# Altium schematic sheet Outputs.SchDoc
size 101 x 152 mm; SheetNumber: 6; SheetTotal: 9
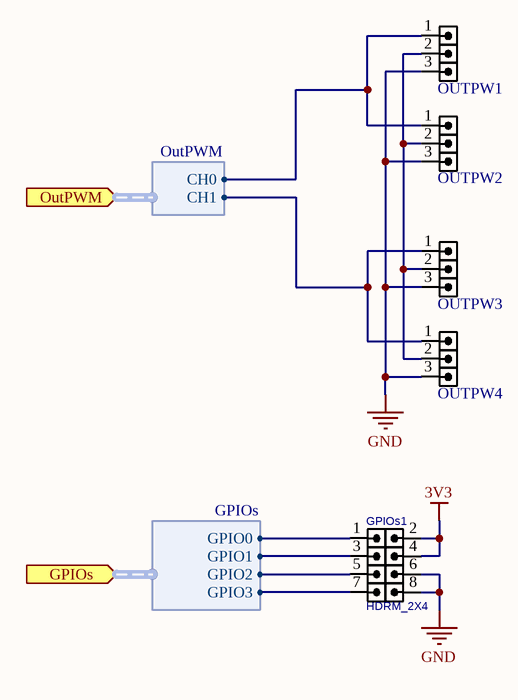
[diagram p0: Outputs.SchDoc]

## Parts
GPIOs1  HDRM_2X4  [HDR_M_2X4]
OUTPW1  HDRM3  [HDR_M_1X3]  (value not drawn)
OUTPW2  HDRM3  [HDR_M_1X3]  (value not drawn)
OUTPW3  HDRM3  [HDR_M_1X3]  (value not drawn)
OUTPW4  HDRM3  [HDR_M_1X3]  (value not drawn)

## Ports
GPIOs (in, harness GPIOs), OutPWM (in, harness OutPWM)

## Harnesses
OutPWM: CH0, CH1
GPIOs: GPIO0, GPIO1, GPIO2, GPIO3

## Nets
3V3: GPIOs1.2 GPIOs1.4
GND: GPIOs1.6 GPIOs1.8 OUTPW1.3 OUTPW2.3 OUTPW3.3 OUTPW4.3
NetGPIOs1_1: GPIOs1.1 ; port GPIOs.GPIO0
NetGPIOs1_3: GPIOs1.3 ; port GPIOs.GPIO1
NetGPIOs1_5: GPIOs1.5 ; port GPIOs.GPIO2
NetGPIOs1_7: GPIOs1.7 ; port GPIOs.GPIO3
NetOUTPW1_1: OUTPW1.1 OUTPW2.1 ; port OutPWM.CH0
NetOUTPW1_2: OUTPW1.2 OUTPW2.2 OUTPW3.2 OUTPW4.2
NetOUTPW3_1: OUTPW3.1 OUTPW4.1 ; port OutPWM.CH1

## Library data of the parts
GPIOs1 = HDR_M_2X4: CONN, HEADER, Male, pitch: 2.54mm, 8POS; MANF_P#: MANF_PART#; MANF: MANF; VALUE: HDRM_2X4
OUTPW1-OUTPW4 = HDR_M_1X3: CONN, HEADER, Male, pitch: 2.54mm, 3POS; VALUE: HDRM3